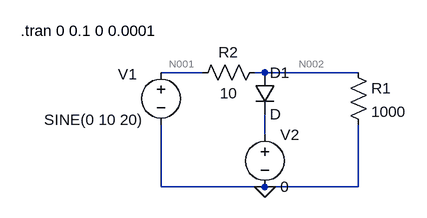
[diagram p0: schematic clipper.asc]
clipper.asc, the LTspice schematic file:
Version 4
SHEET 1 880 680
WIRE 96 112 32 112
WIRE 192 112 176 112
WIRE 336 112 192 112
WIRE 192 208 192 176
WIRE 32 288 32 192
WIRE 192 288 32 288
WIRE 336 288 336 192
WIRE 336 288 192 288
FLAG 192 288 0
SYMBOL diode 176 112 R0
SYMATTR InstName D1
SYMBOL res 320 96 R0
SYMATTR InstName R1
SYMATTR Value 1000
SYMBOL voltage 32 96 R0
WINDOW 0 -66 19 Left 2
WINDOW 3 -180 89 Left 2
WINDOW 123 0 0 Left 2
WINDOW 39 0 0 Left 2
SYMATTR InstName V1
SYMATTR Value SINE(0 10 20)
SYMBOL res 80 128 R270
WINDOW 0 32 56 VTop 2
WINDOW 3 0 56 VBottom 2
SYMATTR InstName R2
SYMATTR Value 10
SYMBOL voltage 192 192 R0
WINDOW 123 0 0 Left 2
WINDOW 39 0 0 Left 2
SYMATTR InstName V2
SYMATTR Value 0
TEXT -184 48 Left 2 !.tran 0 0.1 0 0.0001

The netlist it stands for:
* clipper.asc
D1 N002 N003 D
R1 N002 0 1000
V1 N001 0 SINE(0 10 20)
R2 N001 N002 10
V2 N003 0 0
.model D D
.lib standard.dio
.tran 0 0.1 0 0.0001
.backanno
.end

* Results of the author's LTspice run, read from the files saved beside the schematic
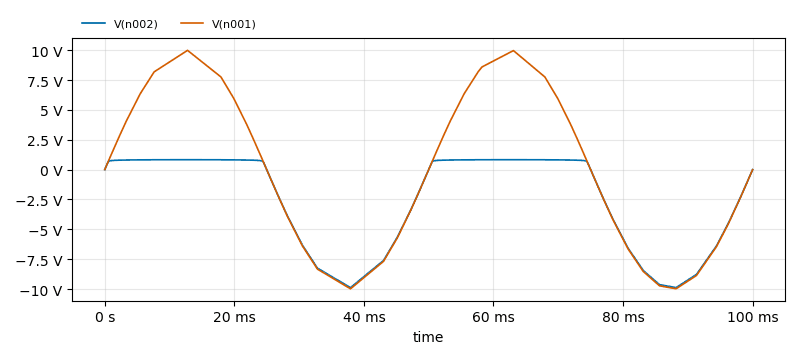
[diagram p1: Transient Analysis of clipper.asc, plotted from the saved traces]
* Transient Analysis, 1 run:
*   V(n002): min -9.876 V, max 831.6 mV, average -2.705 V, rms 4.922 V, last 0 V
*   V(n001): min -9.975 V, max 9.983 V, average -18.09 mV, rms 6.958 V, last 0 V